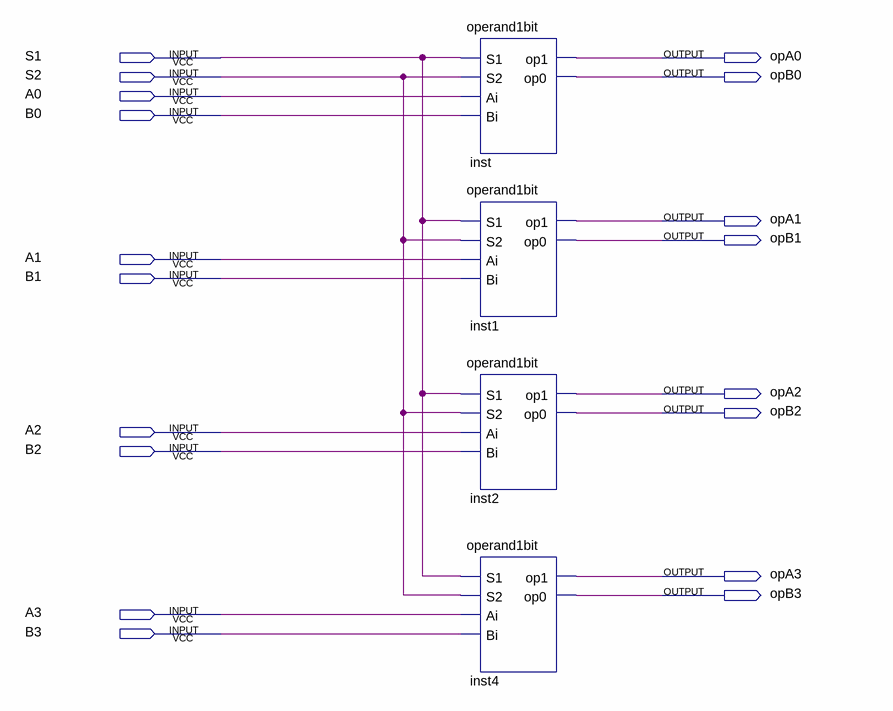
[diagram p0: schematic sheet]
// Quartus schematic operand4bits.bdf as structural Verilog: 4 symbols, 18 pins
module operand4bits (
  input  S1,
  input  S2,
  input  A0,
  input  B0,
  input  A1,
  input  B1,
  input  A2,
  input  B2,
  input  A3,
  input  B3,
  output opA0,
  output opB0,
  output opA1,
  output opB1,
  output opA2,
  output opB2,
  output opA3,
  output opB3
);

  operand1bit inst (.S1(S1), .S2(S2), .Ai(A0), .Bi(B0), .op1(opA0), .op0(opB0));
  operand1bit inst1 (.S1(S1), .S2(S2), .Ai(A1), .Bi(B1), .op1(opA1), .op0(opB1));
  operand1bit inst2 (.S1(S1), .S2(S2), .Ai(A2), .Bi(B2), .op1(opA2), .op0(opB2));
  operand1bit inst4 (.S1(S1), .S2(S2), .Ai(A3), .Bi(B3), .op1(opA3), .op0(opB3));
endmodule
